# EAGLE design EggNunciator (EAGLE 4.13)
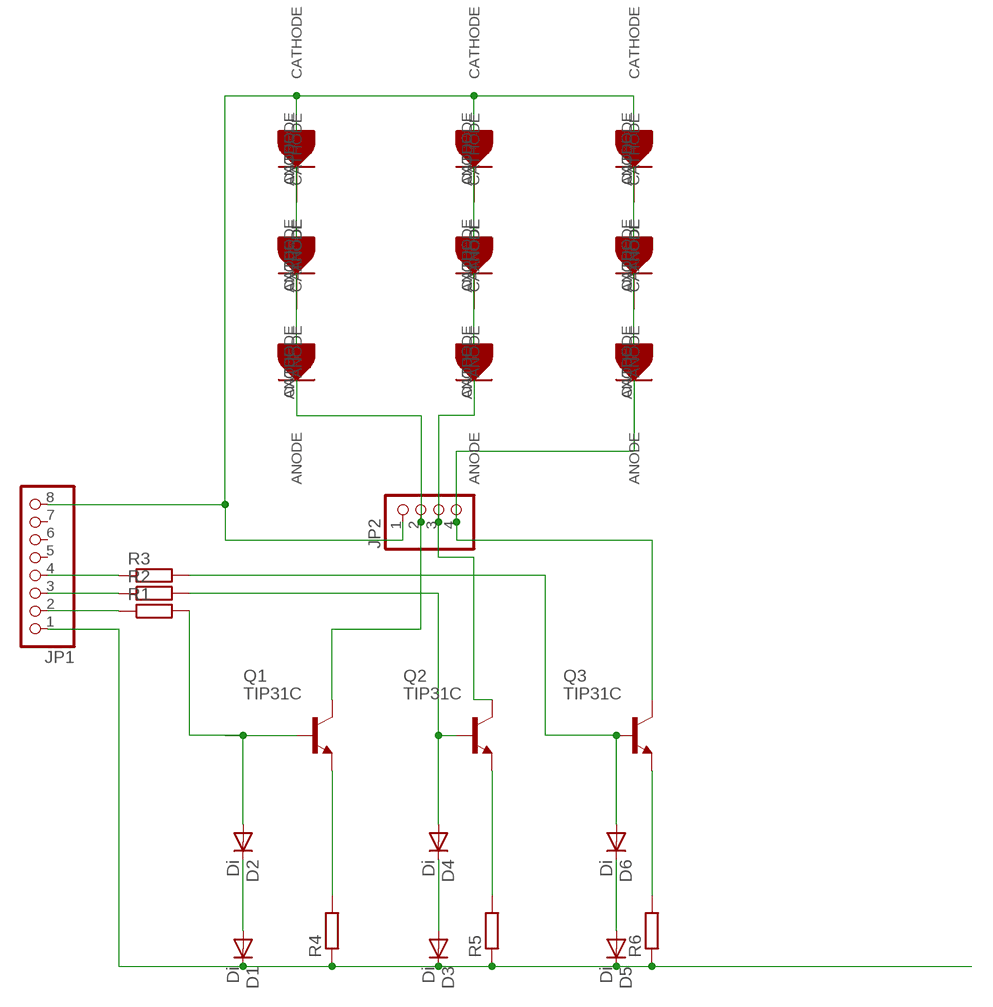
[diagram p0: schematic, sheet 1]

## Parts
D1  Di  ES2D  [SMB]
D2  Di  ES2D  [SMB]
D3  Di  ES2D  [SMB]
D4  Di  ES2D  [SMB]
D5  Di  ES2D  [SMB]
D6  Di  ES2D  [SMB]
JP1  PINHD-1X8  [1X08]
JP2  PINHD-1X4  [1X04]
Q1  TIP31C  [TO220]
Q2  TIP31C  [TO220]
Q3  TIP31C  [TO220]
R1  R-EU_M1206  [M1206]
R2  R-EU_M1206  [M1206]
R3  R-EU_M1206  [M1206]
R4  R-EU_0207/10  [0207/10]
R5  R-EU_0207/10  [0207/10]
R6  R-EU_0207/10  [0207/10]
RED  SUPERFLUXLED  [SUPERFLUXLED]
U$2  SUPERFLUXLED  [SUPERFLUXLED]
U$3  SUPERFLUXLED  [SUPERFLUXLED]
U$4  SUPERFLUXLED  [SUPERFLUXLED]
U$5  SUPERFLUXLED  [SUPERFLUXLED]
U$6  SUPERFLUXLED  [SUPERFLUXLED]
U$7  SUPERFLUXLED  [SUPERFLUXLED]
U$8  SUPERFLUXLED  [SUPERFLUXLED]
U$9  SUPERFLUXLED  [SUPERFLUXLED]

## Nets
GND: D1.C D3.C D5.C JP1.1 R4.1 R5.1 R6.1
N$1: D1.A D2.C
N$2: JP1.2 R1.1
N$3: JP1.3 R2.1
N$4: JP1.4 R3.1
N$5: D5.A D6.C
N$6: D3.A D4.C
N$8: D2.A Q1.1(B) R1.2
N$9: Q1.3(E) R4.2
N$10: D4.A Q2.1(B) R2.2
N$11: Q2.3(E) R5.2
N$12: Q3.3(E) R6.2
N$13: D6.A Q3.1(B) R3.2
N$14: JP1.8 JP2.1 U$3.CATHODE U$6.CATHODE U$9.CATHODE
N$15: JP2.2 Q1.2(C) RED.ANODE
N$16: JP2.3 Q2.2(C) U$4.ANODE
N$17: JP2.4 Q3.2(C) U$7.ANODE
N$18: U$7.CATHODE U$8.ANODE
N$19: U$4.CATHODE U$5.ANODE
N$20: RED.CATHODE U$2.ANODE
N$21: U$2.CATHODE U$3.ANODE
N$22: U$5.CATHODE U$6.ANODE
N$23: U$8.CATHODE U$9.ANODE
Unconnected: JP1.5 JP1.6 JP1.7

## Library data of the parts
D1-D6 = diode:ES2D: DIODE super fast rectifier, 2 A
JP1 = pinhead:PINHD-1X8: PIN HEADER
JP2 = pinhead:PINHD-1X4: PIN HEADER
Q1-Q3 = transistor-npn:TIP31C*: NPN Transistor
R1-R6 = rcl:R-EU_: RESISTOR, European symbol
RED U$2-U$9 = LumiLed:SUPERFLUXLED

## Net classes
0 default: width 0.406 mm, drill 0.508 mm

## Board
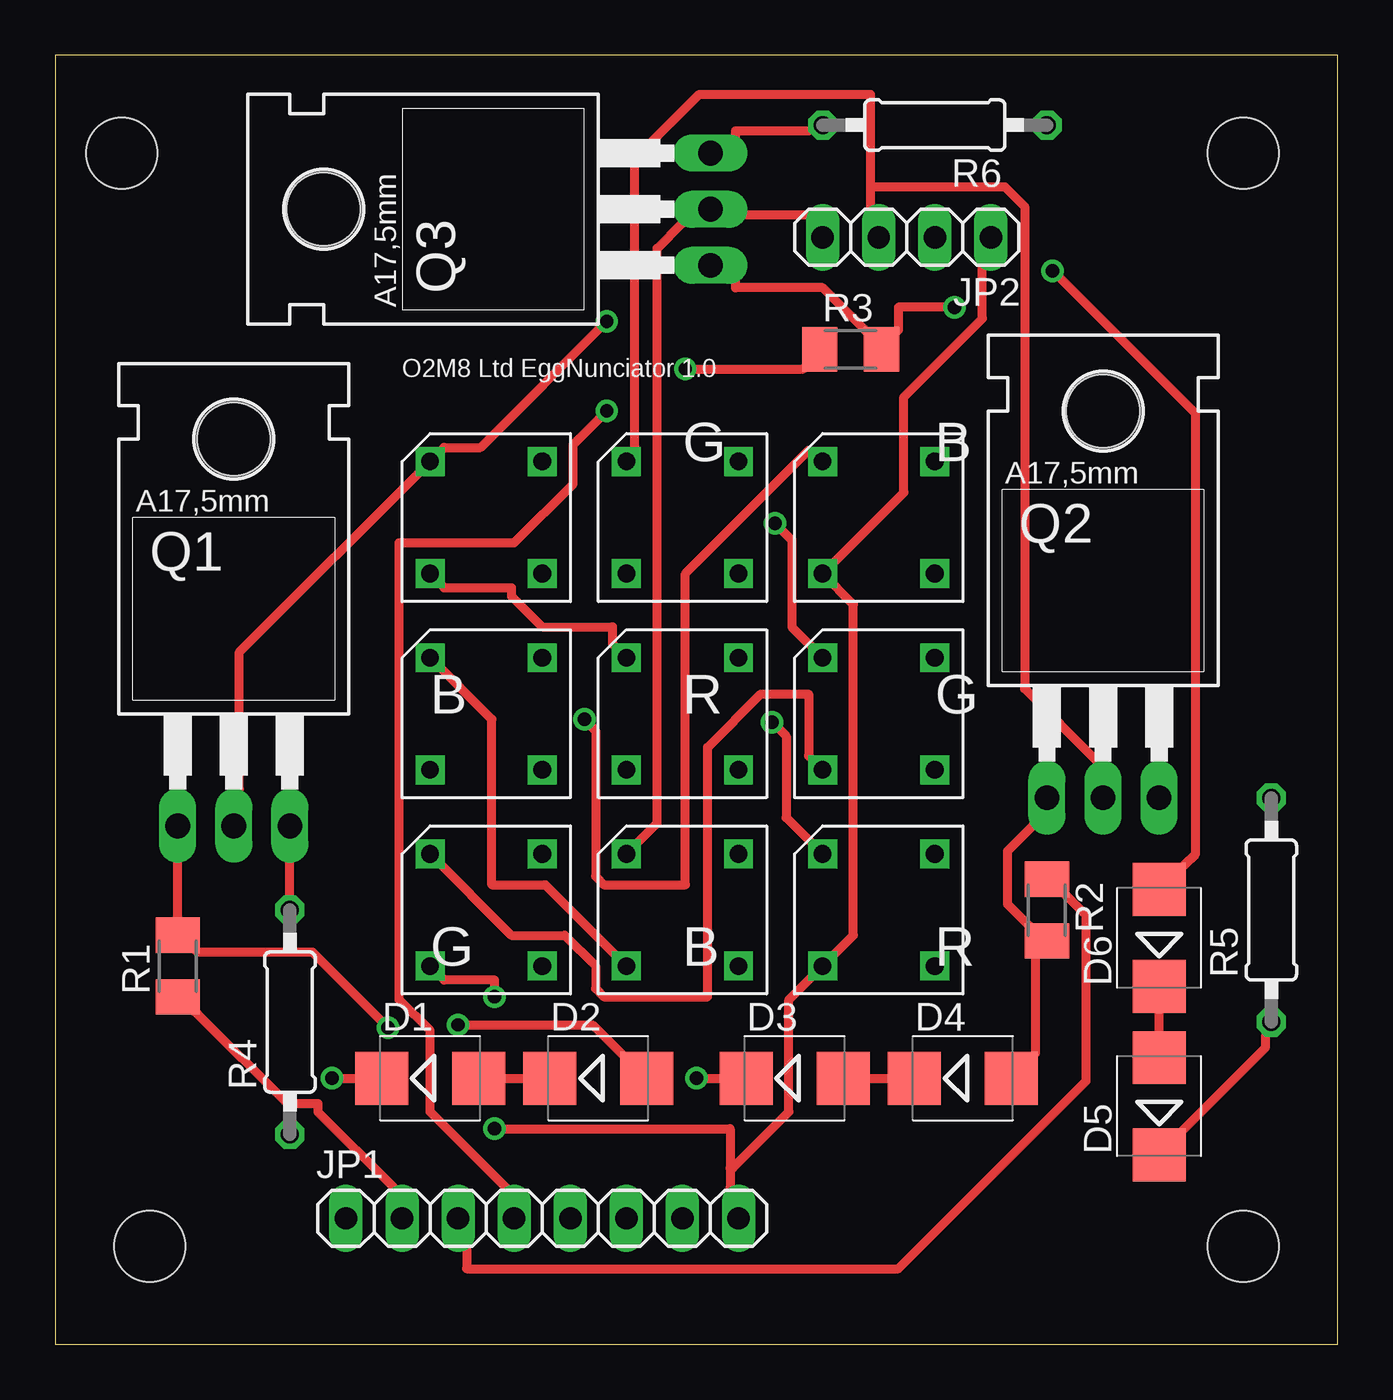
[diagram p1: board, top side]
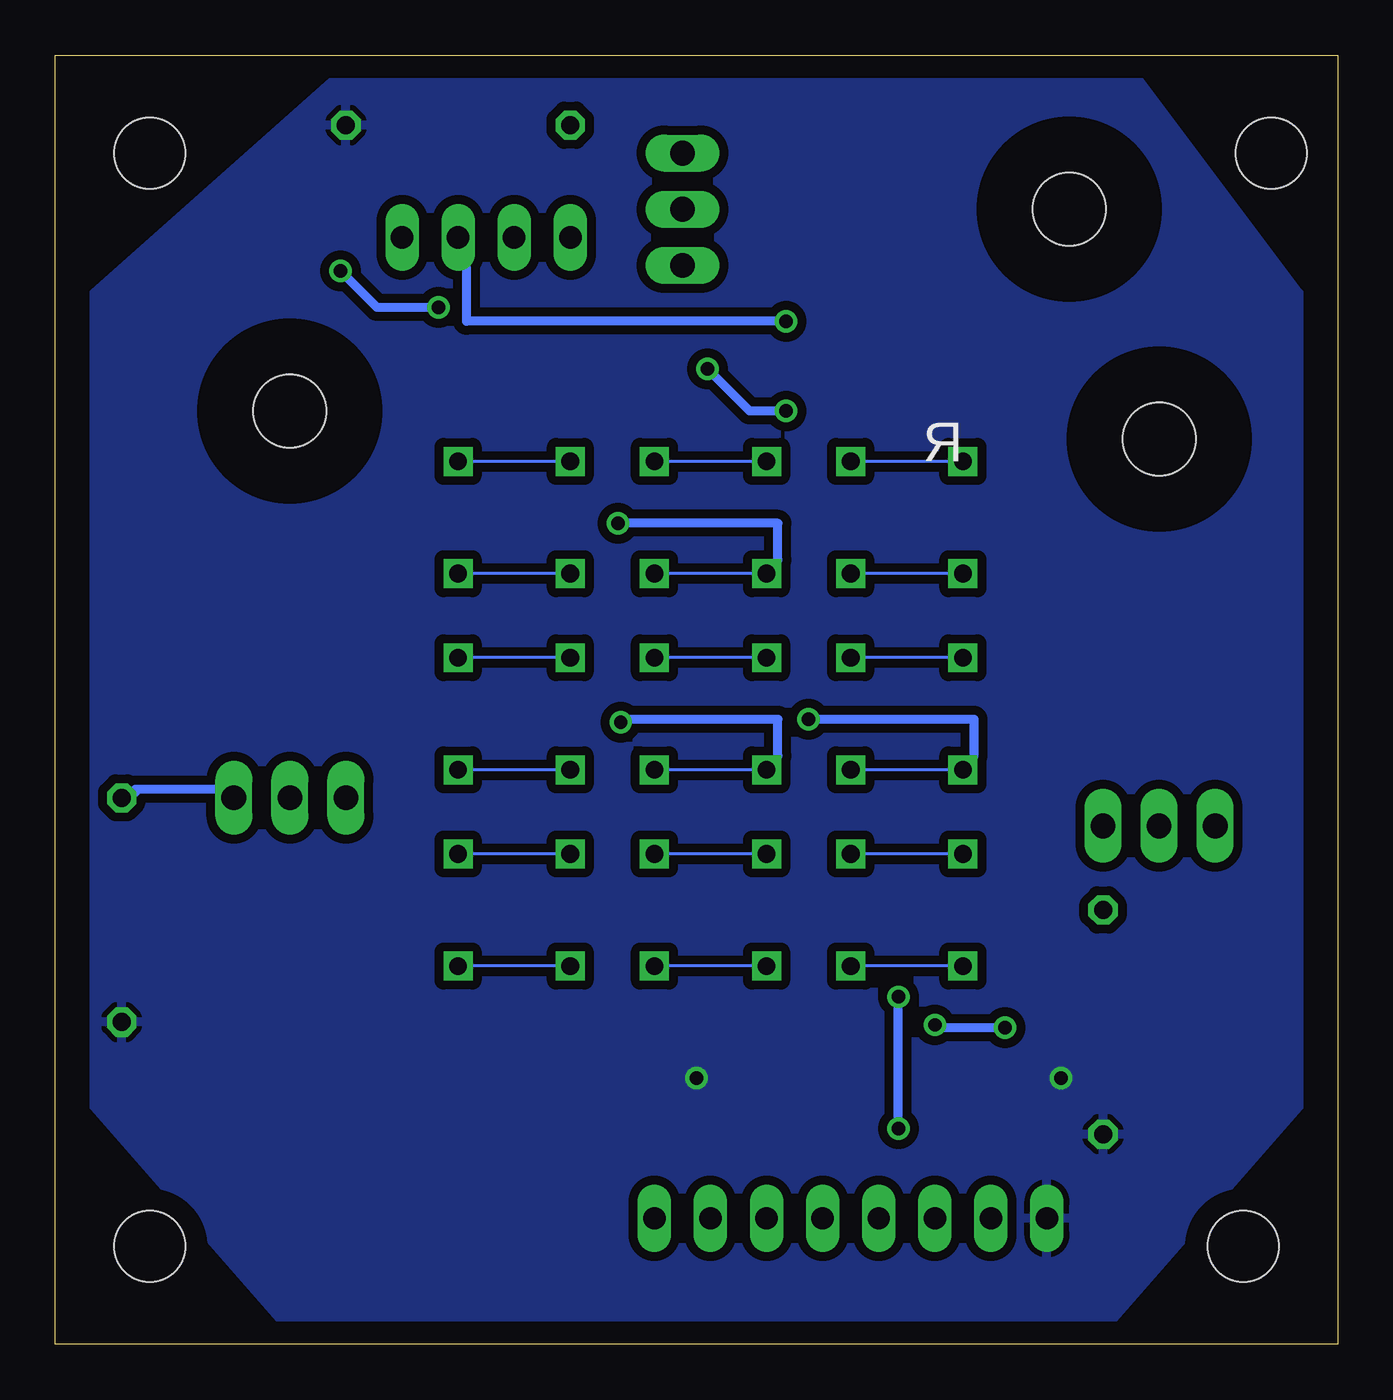
[diagram p2: board, bottom side, seen from below]

Size 58.09 x 58.41 mm. Coordinates in mm from the lower left corner, seen from the top.
Outline: 0,0 58.09,0 58.09,58.41 0,58.41 0,0
Copper layers (1*16): Top 0.035mm / dielectric 1.5mm / Bottom 0.035mm
Design rules "default": minimum track width 10mil, minimum drill 24mil, track to track 16mil, track to pad 16mil, pad to pad 12mil, via to via 12mil, smd to smd 12mil, copper to edge 40mil, drill to drill 8mil, minimum pad ring 10mil, minimum via ring 8mil, stop-mask expansion 4mil, vias tented up to drill 0mil, thermal gap 10mil
Holes 3.2 mm at 3.01,53.97 53.81,53.97 53.81,4.44 4.28,4.44

### Footprints (pad centres in the part's own frame; a part is rotated, then mirrored left to right if it is on the bottom)
SMB = smd 2.4 x 2.4: A 2.2,0; C -2.2,0
1X08 = drill 1.016 long: 1 -8.89,0; 2 -6.35,0; 3 -3.81,0; 4 -1.27,0; 5 1.27,0; 6 3.81,0; 7 6.35,0; 8 8.89,0
1X04 = drill 1.016 long: 1 -3.81,0; 2 -1.27,0; 3 1.27,0; 4 3.81,0
TO220 = drill 1.118 long: 1 -2.54,-6.35; 2 0,-6.35; 3 2.54,-6.35 | hole 3.302: 0,11.176
M1206 = smd 1.6 x 2: 1 -1.4,0; 2 1.4,0
0207/10 = drill 0.813 octagon: 1 -5.08,0; 2 5.08,0
SUPERFLUXLED = drill 0.8 square: ANODE -2.54,2.54; CATHODE -2.54,-2.54; P$2 2.54,2.54; P$4 2.54,-2.54

### Placement (x,y rotation side)
D1  16.98,12.06 0 top
D2  24.6,12.06 0 top
D3  33.49,12.06 0 top
D4  41.11,12.06 0 top
D5  50,10.79 90 top
D6  50,18.41 90 top
JP1  22.06,5.71 0 top
JP2  38.57,50.16 180 top
Q1  8.09,29.84 0 top
Q2  47.46,31.11 0 top
Q3  23.33,51.43 90 top
R1  5.55,17.14 90 top
R2  44.92,19.68 270 top
R3  36.03,45.08 0 top
R4  10.63,14.6 90 top
R5  55.08,19.68 90 top
R6  39.84,55.24 180 top
RED  19.52,37.46 0 top
U$2  28.41,28.57 0 top
U$3  37.3,19.68 0 top
U$4  28.41,37.46 0 top
U$5  37.3,28.57 0 top
U$6  19.52,19.68 0 top
U$7  28.41,19.68 0 top
U$8  19.52,28.57 0 top
U$9  37.3,37.46 0 top

### Tracks (layer width: path | path; a pad name or v marks a point on that pad's centre or on a via)
GND  (via drill 0.61)
  Top 0.406: v12.54,12.06 D1.C | v29.04,12.06 D3.C | D5.C 51.14,9.77 54.83,13.46 54.83,13.96 R5.1
  pour Bottom: 1.74,47.62 9.36,57.78 44.92,57.78 56.35,47.62 56.35,10.79 47.46,0.63 10.63,0.63 1.74,10.79
N$1
  Top 0.406: D1.A D2.C
N$2
  Top 0.406: R1.1 6.44,14.98 10.5,10.92 11.9,10.92 11.9,10.54 15.33,7.11 JP1.2
N$3
  Top 0.406: R2.1 45.81,20.32 46.7,19.43 46.7,11.93 38.19,3.42 18.63,3.42 18.63,4.31 JP1.3
N$4  (via drill 0.61)
  Top 0.406: v28.54,44.19 33.87,44.19 R3.1 | v24.98,42.29 23.46,40.76 23.46,38.98 20.79,36.32 15.58,36.32 15.58,15.62 16.98,14.22 16.98,10.54 20.41,7.11 JP1.4
  Bottom 0.406: v28.54,44.19 26.63,42.29 v24.98,42.29
N$5
  Top 0.406: D5.A D6.C
N$6
  Top 0.406: D3.A D4.C
N$8  (via drill 0.61)
  Top 0.406: Q1.1 R1.2 6.44,17.77 11.65,17.77 v15.07,14.35 | v18.25,14.47 24.35,14.47 25.62,13.2 D2.A
  Bottom 0.406: v18.25,14.47 18.12,14.35 v15.07,14.35
N$9
  Top 0.406: R4.2 Q1.3
N$10
  Top 0.406: D4.A 44.41,13.2 44.41,17.52 R2.2 44.03,19.04 43.14,19.93 43.14,22.35 44.28,23.49 Q2.1
N$11
  Bottom 0.406: R5.2 54.44,25.01 54.44,25.14 50.76,25.14 Q2.3
N$12
  Top 0.406: R6.2 34.12,54.99 30.82,54.99 30.82,54.73 Q3.3
N$13  (via drill 0.61)
  Top 0.406: Q3.1 30.82,48.13 30.82,47.87 34.76,47.87 36.66,45.97 R3.2 38.19,45.97 38.19,46.98 v40.73,46.98 | v45.17,48.64 51.65,42.16 51.65,22.22 51.14,21.71 D6.A
  Bottom 0.406: v45.17,48.64 43.52,46.98 v40.73,46.98
N$14  (via drill 0.61)
  Top 0.406: JP2.1 42,48.76 42,46.48 38.44,42.92 38.44,38.6 U$9.CATHODE 36.16,33.52 36.16,18.54 U$3.CATHODE 33.24,15.62 33.24,10.54 30.7,8 30.57,8 | v19.9,15.74 19.9,16.5 17.61,16.5 U$6.CATHODE | v19.9,9.77 30.57,9.77 30.57,8 | 30.57,8 30.57,7.11 JP1.8
  Bottom 0.406: v19.9,9.77 v19.9,15.74
N$15  (via drill 0.61)
  Top 0.406: Q1.2 8.34,25.14 8.34,31.36 RED.ANODE 17.61,40.64 19.27,40.64 v24.98,46.35
  Bottom 0.406: v24.98,46.35 39.46,46.35 39.46,48.76 JP2.2
N$16
  Top 0.406: 36.92,52.45 36.92,51.56 JP2.3 | 36.92,52.45 36.92,56.64 29.17,56.64 26.25,53.72 26.25,40.64 U$4.ANODE | Q2.2 47.21,26.41 43.9,29.71 43.9,51.56 43.02,52.45 36.92,52.45
N$17
  Top 0.406: U$7.ANODE 27.27,23.62 27.27,49.65 28.41,50.8 Q3.2 31.33,51.18 34.12,51.18 JP2.4
N$18
  Top 0.406: U$7.CATHODE 22.19,20.82 19.77,20.82 19.77,28.32 U$8.ANODE
N$19  (via drill 0.61)
  Top 0.406: v32.6,37.21 33.36,36.44 33.36,32.51 U$5.ANODE
  Bottom 0.406: v32.6,37.21 25.36,37.21 25.36,35.56 U$4.CATHODE
N$20
  Top 0.406: RED.CATHODE 17.61,34.28 20.66,34.28 20.66,33.9 22.06,32.51 25.23,32.51 25.23,31.75 U$2.ANODE
N$21  (via drill 0.61)
  Top 0.406: v32.47,28.19 33.11,27.55 33.11,23.87 U$3.ANODE
  Bottom 0.406: v32.47,28.19 32.35,28.32 25.36,28.32 25.36,26.67 U$2.CATHODE
N$22
  Top 0.406: U$6.ANODE 20.66,18.54 23.08,18.54 24.47,17.14 24.47,16.12 24.85,15.74 29.55,15.74 29.55,27.05 31.97,29.46 34.12,29.46 34.12,26.67 U$5.CATHODE
N$23  (via drill 0.61)
  Top 0.406: v23.96,28.32 24.47,27.81 24.47,21.2 24.85,20.82 28.54,20.82 28.54,34.92 34.12,40.51 U$9.ANODE
  Bottom 0.406: v23.96,28.32 16.47,28.32 16.47,26.67 U$8.CATHODE

### Text on the board
tNames: O2M8 Ltd EggNunciator 1.0 | G | B | B | R | G | G | B | R
bNames: R